# EAGLE design LOGO LED board (EAGLE 9.5.0)
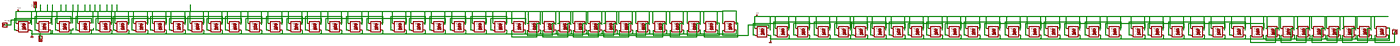
[diagram p0: schematic, sheet 1, overview]
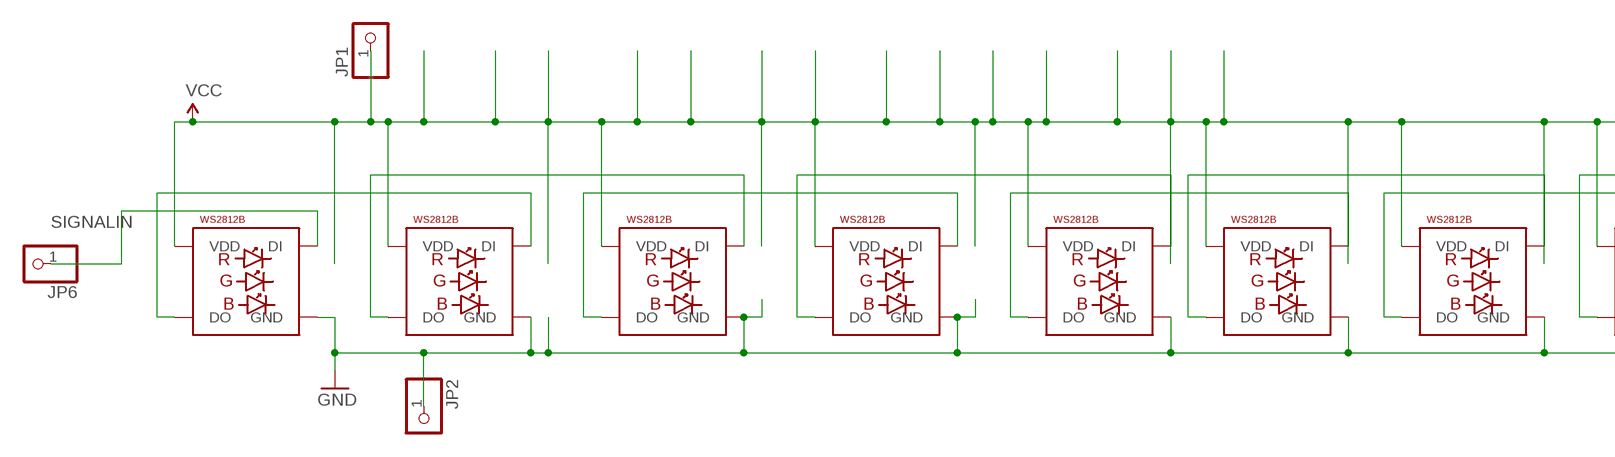
[diagram p1: schematic, sheet 1, part 1 of 8]
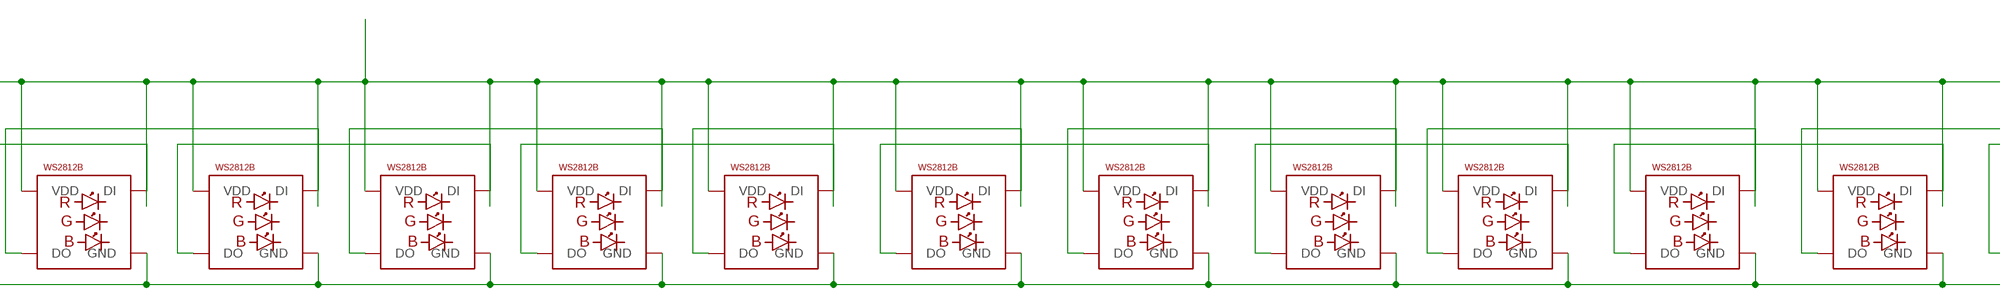
[diagram p2: schematic, sheet 1, part 2 of 8]
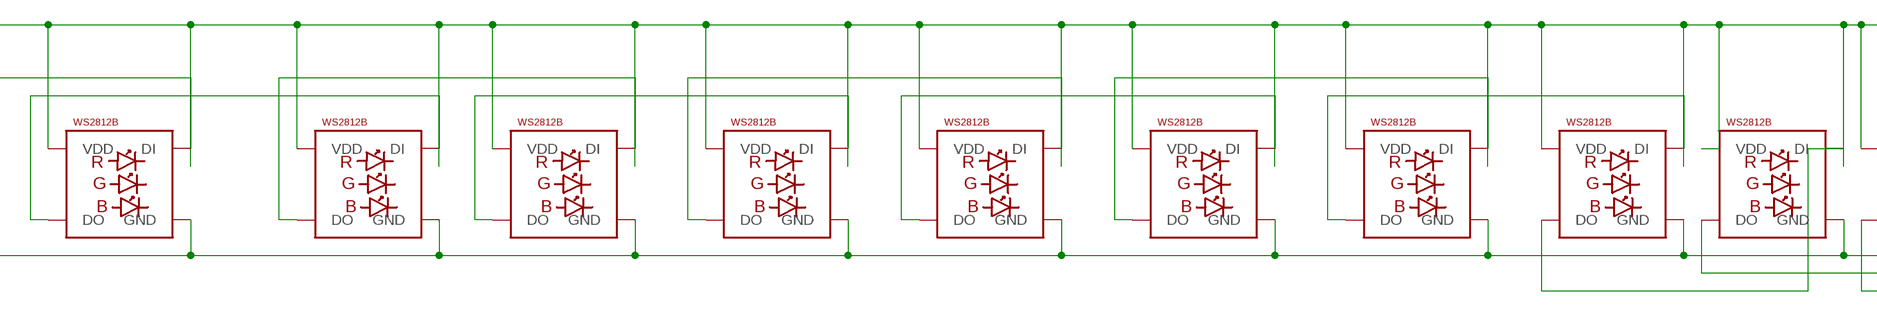
[diagram p3: schematic, sheet 1, part 3 of 8]
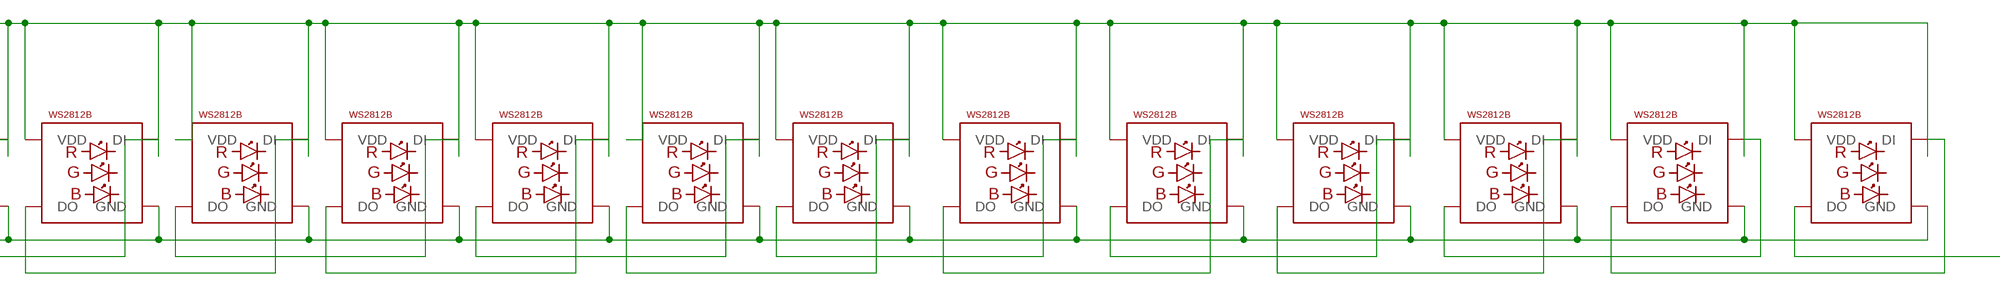
[diagram p4: schematic, sheet 1, part 4 of 8]
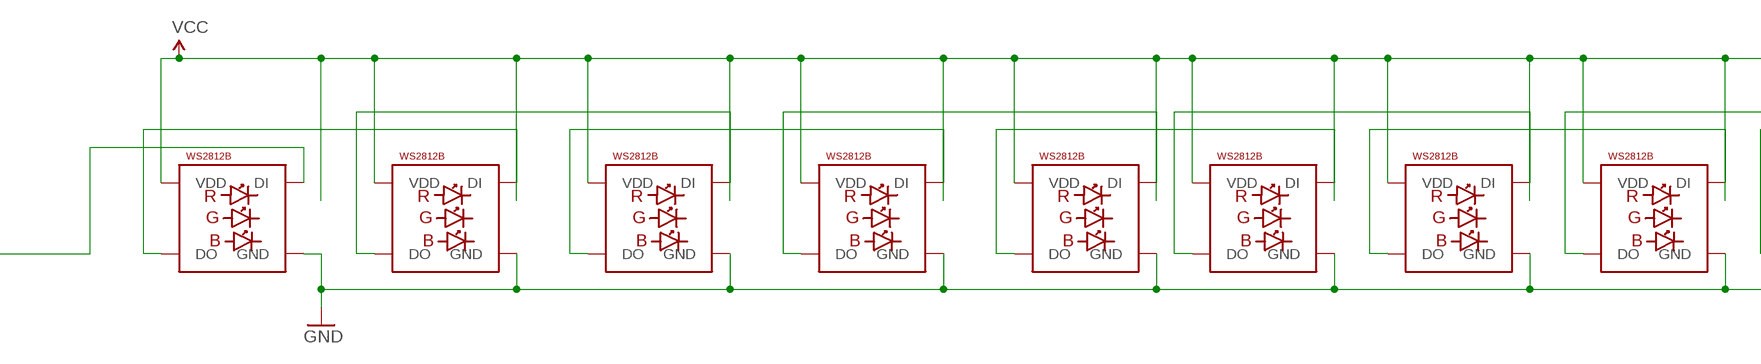
[diagram p5: schematic, sheet 1, part 5 of 8]
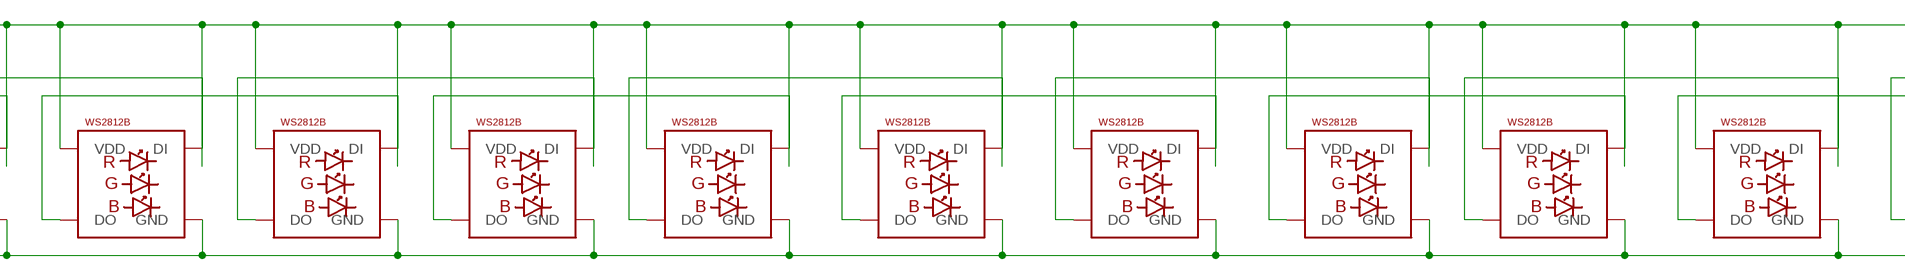
[diagram p6: schematic, sheet 1, part 6 of 8]
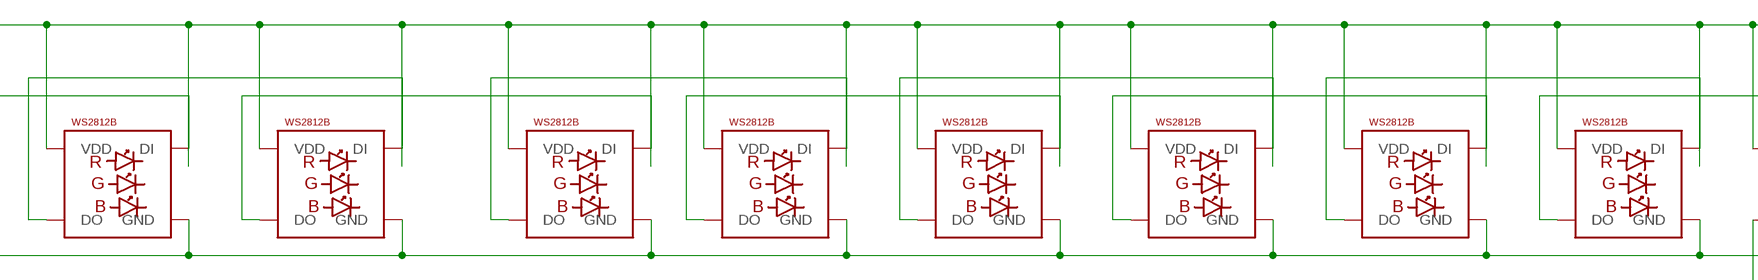
[diagram p7: schematic, sheet 1, part 7 of 8]
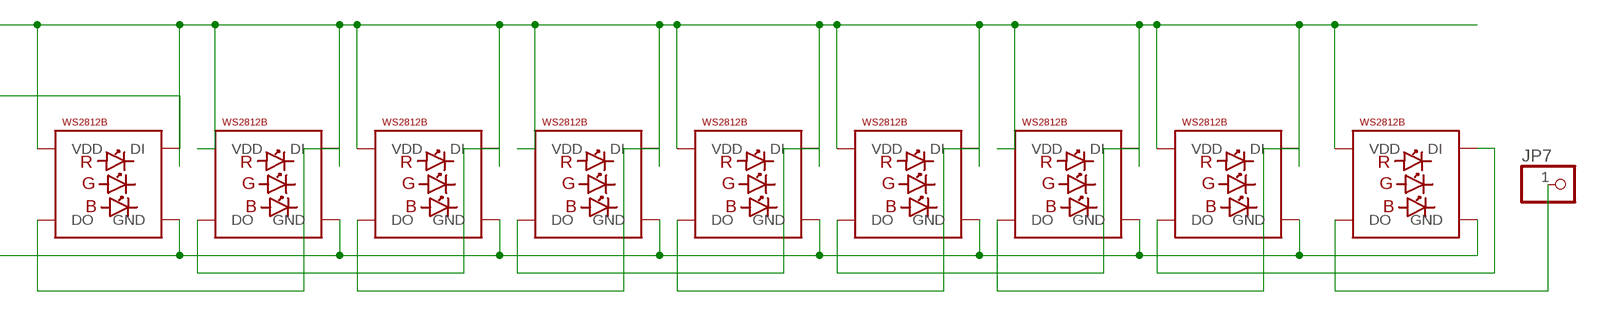
[diagram p8: schematic, sheet 1, part 8 of 8]

## Parts
JP1  PINHD-1X1  [1X01]
JP2  PINHD-1X1  [1X01]
JP6  PINHD-1X1  [1X01]
JP7  PINHD-1X1  [1X01]
LED1  WS2812B5050  [WS2812B]
LED2  WS2812B5050  [WS2812B]
LED3  WS2812B5050  [WS2812B]
LED4  WS2812B5050  [WS2812B]
LED5  WS2812B5050  [WS2812B]
LED6  WS2812B5050  [WS2812B]
LED7  WS2812B5050  [WS2812B]
LED8  WS2812B5050  [WS2812B]
LED9  WS2812B5050  [WS2812B]
LED10  WS2812B5050  [WS2812B]
LED11  WS2812B5050  [WS2812B]
LED12  WS2812B5050  [WS2812B]
LED13  WS2812B5050  [WS2812B]
LED14  WS2812B5050  [WS2812B]
LED15  WS2812B5050  [WS2812B]
LED16  WS2812B5050  [WS2812B]
LED17  WS2812B5050  [WS2812B]
LED18  WS2812B5050  [WS2812B]
LED19  WS2812B5050  [WS2812B]
LED20  WS2812B5050  [WS2812B]
LED21  WS2812B5050  [WS2812B]
LED22  WS2812B5050  [WS2812B]
LED23  WS2812B5050  [WS2812B]
LED24  WS2812B5050  [WS2812B]
LED25  WS2812B5050  [WS2812B]
LED26  WS2812B5050  [WS2812B]
LED27  WS2812B5050  [WS2812B]
LED28  WS2812B5050  [WS2812B]
LED29  WS2812B5050  [WS2812B]
LED30  WS2812B5050  [WS2812B]
LED31  WS2812B5050  [WS2812B]
LED32  WS2812B5050  [WS2812B]
LED33  WS2812B5050  [WS2812B]
LED34  WS2812B5050  [WS2812B]
LED35  WS2812B5050  [WS2812B]
LED36  WS2812B5050  [WS2812B]
LED37  WS2812B5050  [WS2812B]
LED38  WS2812B5050  [WS2812B]
LED39  WS2812B5050  [WS2812B]
LED40  WS2812B5050  [WS2812B]
LED41  WS2812B5050  [WS2812B]
LED42  WS2812B5050  [WS2812B]
LED43  WS2812B5050  [WS2812B]
LED44  WS2812B5050  [WS2812B]
LED45  WS2812B5050  [WS2812B]
LED46  WS2812B5050  [WS2812B]
LED47  WS2812B5050  [WS2812B]
LED48  WS2812B5050  [WS2812B]
LED49  WS2812B5050  [WS2812B]
LED50  WS2812B5050  [WS2812B]
LED51  WS2812B5050  [WS2812B]
LED52  WS2812B5050  [WS2812B]
LED53  WS2812B5050  [WS2812B]
LED54  WS2812B5050  [WS2812B]
LED55  WS2812B5050  [WS2812B]
LED56  WS2812B5050  [WS2812B]
LED57  WS2812B5050  [WS2812B]
LED58  WS2812B5050  [WS2812B]
LED59  WS2812B5050  [WS2812B]
LED60  WS2812B5050  [WS2812B]
LED61  WS2812B5050  [WS2812B]
LED62  WS2812B5050  [WS2812B]
LED63  WS2812B5050  [WS2812B]
LED64  WS2812B5050  [WS2812B]
LED65  WS2812B5050  [WS2812B]
LED66  WS2812B5050  [WS2812B]
LED67  WS2812B5050  [WS2812B]
LED68  WS2812B5050  [WS2812B]
LED69  WS2812B5050  [WS2812B]
LED70  WS2812B5050  [WS2812B]
LED71  WS2812B5050  [WS2812B]
LED72  WS2812B5050  [WS2812B]
LED73  WS2812B5050  [WS2812B]

## Nets
5V: JP1.1 LED1.1-VDD(VDD) LED2.1-VDD(VDD) LED3.1-VDD(VDD) LED4.1-VDD(VDD) LED5.1-VDD(VDD) LED6.1-VDD(VDD) LED7.1-VDD(VDD) LED8.1-VDD(VDD) LED9.1-VDD(VDD) LED10.1-VDD(VDD) LED11.1-VDD(VDD) LED12.1-VDD(VDD) LED13.1-VDD(VDD) LED14.1-VDD(VDD) LED15.1-VDD(VDD) LED16.1-VDD(VDD) LED17.1-VDD(VDD) LED18.1-VDD(VDD) LED19.1-VDD(VDD) LED20.1-VDD(VDD) LED21.1-VDD(VDD) LED22.1-VDD(VDD) LED23.1-VDD(VDD) LED24.1-VDD(VDD) LED25.1-VDD(VDD) LED26.1-VDD(VDD) LED27.1-VDD(VDD) LED28.1-VDD(VDD) LED29.1-VDD(VDD) LED30.1-VDD(VDD) LED31.1-VDD(VDD) LED32.1-VDD(VDD) LED33.1-VDD(VDD) LED34.1-VDD(VDD) LED35.1-VDD(VDD) LED36.1-VDD(VDD) LED37.1-VDD(VDD) LED38.1-VDD(VDD) LED39.1-VDD(VDD) LED40.1-VDD(VDD) LED41.1-VDD(VDD) LED42.1-VDD(VDD) LED43.1-VDD(VDD) LED44.1-VDD(VDD) LED45.1-VDD(VDD) LED46.1-VDD(VDD) LED47.1-VDD(VDD) LED48.1-VDD(VDD) LED49.1-VDD(VDD) LED50.1-VDD(VDD) LED51.1-VDD(VDD) LED52.1-VDD(VDD) LED53.1-VDD(VDD) LED54.1-VDD(VDD) LED55.1-VDD(VDD) LED56.1-VDD(VDD) LED57.1-VDD(VDD) LED58.1-VDD(VDD) LED59.1-VDD(VDD) LED60.1-VDD(VDD) LED61.1-VDD(VDD) LED62.1-VDD(VDD) LED63.1-VDD(VDD) LED64.1-VDD(VDD) LED65.1-VDD(VDD) LED66.1-VDD(VDD) LED67.1-VDD(VDD) LED68.1-VDD(VDD) LED69.1-VDD(VDD) LED70.1-VDD(VDD) LED71.1-VDD(VDD) LED72.1-VDD(VDD) LED73.1-VDD(VDD) ; supply symbol labelled VCC
GND: JP2.1 LED1.3-GND(GND) LED2.3-GND(GND) LED3.3-GND(GND) LED4.3-GND(GND) LED5.3-GND(GND) LED6.3-GND(GND) LED7.3-GND(GND) LED8.3-GND(GND) LED9.3-GND(GND) LED10.3-GND(GND) LED11.3-GND(GND) LED12.3-GND(GND) LED13.3-GND(GND) LED14.3-GND(GND) LED15.3-GND(GND) LED16.3-GND(GND) LED17.3-GND(GND) LED18.3-GND(GND) LED19.3-GND(GND) LED20.3-GND(GND) LED21.3-GND(GND) LED22.3-GND(GND) LED23.3-GND(GND) LED24.3-GND(GND) LED25.3-GND(GND) LED26.3-GND(GND) LED27.3-GND(GND) LED28.3-GND(GND) LED29.3-GND(GND) LED30.3-GND(GND) LED31.3-GND(GND) LED32.3-GND(GND) LED33.3-GND(GND) LED34.3-GND(GND) LED35.3-GND(GND) LED36.3-GND(GND) LED37.3-GND(GND) LED38.3-GND(GND) LED39.3-GND(GND) LED40.3-GND(GND) LED41.3-GND(GND) LED42.3-GND(GND) LED43.3-GND(GND) LED44.3-GND(GND) LED45.3-GND(GND) LED46.3-GND(GND) LED47.3-GND(GND) LED48.3-GND(GND) LED49.3-GND(GND) LED50.3-GND(GND) LED51.3-GND(GND) LED52.3-GND(GND) LED53.3-GND(GND) LED54.3-GND(GND) LED55.3-GND(GND) LED56.3-GND(GND) LED57.3-GND(GND) LED58.3-GND(GND) LED59.3-GND(GND) LED60.3-GND(GND) LED61.3-GND(GND) LED62.3-GND(GND) LED63.3-GND(GND) LED64.3-GND(GND) LED65.3-GND(GND) LED66.3-GND(GND) LED67.3-GND(GND) LED68.3-GND(GND) LED69.3-GND(GND) LED70.3-GND(GND) LED71.3-GND(GND) LED72.3-GND(GND) LED73.3-GND(GND)
N$1: LED5.2-DOUT(DO) LED6.4-DIN(DI)
N$2: LED1.2-DOUT(DO) LED2.4-DIN(DI)
N$3: LED2.2-DOUT(DO) LED3.4-DIN(DI)
N$4: LED3.2-DOUT(DO) LED4.4-DIN(DI)
N$5: LED4.2-DOUT(DO) LED5.4-DIN(DI)
N$6: LED6.2-DOUT(DO) LED7.4-DIN(DI)
N$7: LED7.2-DOUT(DO) LED8.4-DIN(DI)
N$8: LED8.2-DOUT(DO) LED9.4-DIN(DI)
N$9: LED9.2-DOUT(DO) LED10.4-DIN(DI)
N$10: LED10.2-DOUT(DO) LED11.4-DIN(DI)
N$11: LED11.2-DOUT(DO) LED12.4-DIN(DI)
N$12: LED12.2-DOUT(DO) LED13.4-DIN(DI)
N$13: LED13.2-DOUT(DO) LED14.4-DIN(DI)
N$14: LED14.2-DOUT(DO) LED15.4-DIN(DI)
N$15: LED15.2-DOUT(DO) LED16.4-DIN(DI)
N$16: LED16.2-DOUT(DO) LED17.4-DIN(DI)
N$17: LED17.2-DOUT(DO) LED18.4-DIN(DI)
N$18: LED18.2-DOUT(DO) LED19.4-DIN(DI)
N$19: LED19.2-DOUT(DO) LED20.4-DIN(DI)
N$20: LED20.2-DOUT(DO) LED21.4-DIN(DI)
N$21: LED21.2-DOUT(DO) LED22.4-DIN(DI)
N$22: LED22.2-DOUT(DO) LED23.4-DIN(DI)
N$23: LED23.2-DOUT(DO) LED24.4-DIN(DI)
N$24: LED24.2-DOUT(DO) LED25.4-DIN(DI)
N$25: LED25.2-DOUT(DO) LED26.4-DIN(DI)
N$26: LED26.2-DOUT(DO) LED27.4-DIN(DI)
N$27: LED27.2-DOUT(DO) LED28.4-DIN(DI)
N$28: LED28.2-DOUT(DO) LED29.4-DIN(DI)
N$29: LED29.2-DOUT(DO) LED30.4-DIN(DI)
N$30: LED30.2-DOUT(DO) LED31.4-DIN(DI)
N$31: LED31.2-DOUT(DO) LED32.4-DIN(DI)
N$32: LED32.2-DOUT(DO) LED33.4-DIN(DI)
N$33: LED33.2-DOUT(DO) LED34.4-DIN(DI)
N$34: LED34.2-DOUT(DO) LED35.4-DIN(DI)
N$35: LED35.2-DOUT(DO) LED36.4-DIN(DI)
N$36: LED36.2-DOUT(DO) LED37.4-DIN(DI)
N$37: LED37.2-DOUT(DO) LED38.4-DIN(DI)
N$38: LED38.2-DOUT(DO) LED39.4-DIN(DI)
N$39: LED40.2-DOUT(DO) LED41.4-DIN(DI)
N$40: LED42.2-DOUT(DO) LED43.4-DIN(DI)
N$41: LED43.2-DOUT(DO) LED44.4-DIN(DI)
N$42: LED44.2-DOUT(DO) LED45.4-DIN(DI)
N$43: LED45.2-DOUT(DO) LED46.4-DIN(DI)
N$44: LED46.2-DOUT(DO) LED47.4-DIN(DI)
N$45: LED47.2-DOUT(DO) LED48.4-DIN(DI)
N$46: LED48.2-DOUT(DO) LED49.4-DIN(DI)
N$47: LED49.2-DOUT(DO) LED50.4-DIN(DI)
N$48: LED50.2-DOUT(DO) LED51.4-DIN(DI)
N$49: LED51.2-DOUT(DO) LED52.4-DIN(DI)
N$50: LED52.2-DOUT(DO) LED53.4-DIN(DI)
N$51: LED53.2-DOUT(DO) LED54.4-DIN(DI)
N$52: LED54.2-DOUT(DO) LED55.4-DIN(DI)
N$53: LED55.2-DOUT(DO) LED56.4-DIN(DI)
N$54: LED56.2-DOUT(DO) LED57.4-DIN(DI)
N$55: LED57.2-DOUT(DO) LED58.4-DIN(DI)
N$56: LED58.2-DOUT(DO) LED59.4-DIN(DI)
N$57: LED59.2-DOUT(DO) LED60.4-DIN(DI)
N$58: LED60.2-DOUT(DO) LED61.4-DIN(DI)
N$59: LED61.2-DOUT(DO) LED62.4-DIN(DI)
N$60: LED62.2-DOUT(DO) LED63.4-DIN(DI)
N$61: LED63.2-DOUT(DO) LED64.4-DIN(DI)
N$62: LED64.2-DOUT(DO) LED65.4-DIN(DI)
N$63: LED41.2-DOUT(DO) LED42.4-DIN(DI)
N$64: LED65.2-DOUT(DO) LED66.4-DIN(DI)
N$65: LED66.2-DOUT(DO) LED67.4-DIN(DI)
N$66: LED67.2-DOUT(DO) LED68.4-DIN(DI)
N$67: LED68.2-DOUT(DO) LED69.4-DIN(DI)
N$68: LED69.2-DOUT(DO) LED70.4-DIN(DI)
N$69: LED70.2-DOUT(DO) LED71.4-DIN(DI)
N$70: LED71.2-DOUT(DO) LED72.4-DIN(DI)
N$71: LED72.2-DOUT(DO) LED73.4-DIN(DI)
N$77: LED39.2-DOUT(DO) LED40.4-DIN(DI)
N$80: JP7.1 LED73.2-DOUT(DO)
SIGNALIN: JP6.1 LED1.4-DIN(DI)

## Library data of the parts
JP1 JP2 JP6 JP7 = adafruit:PINHD-1X1: Pin header 1x1 for 0.1" spacing With round pins
LED1-LED73 = freetronics-jon:WS2812B

## Board
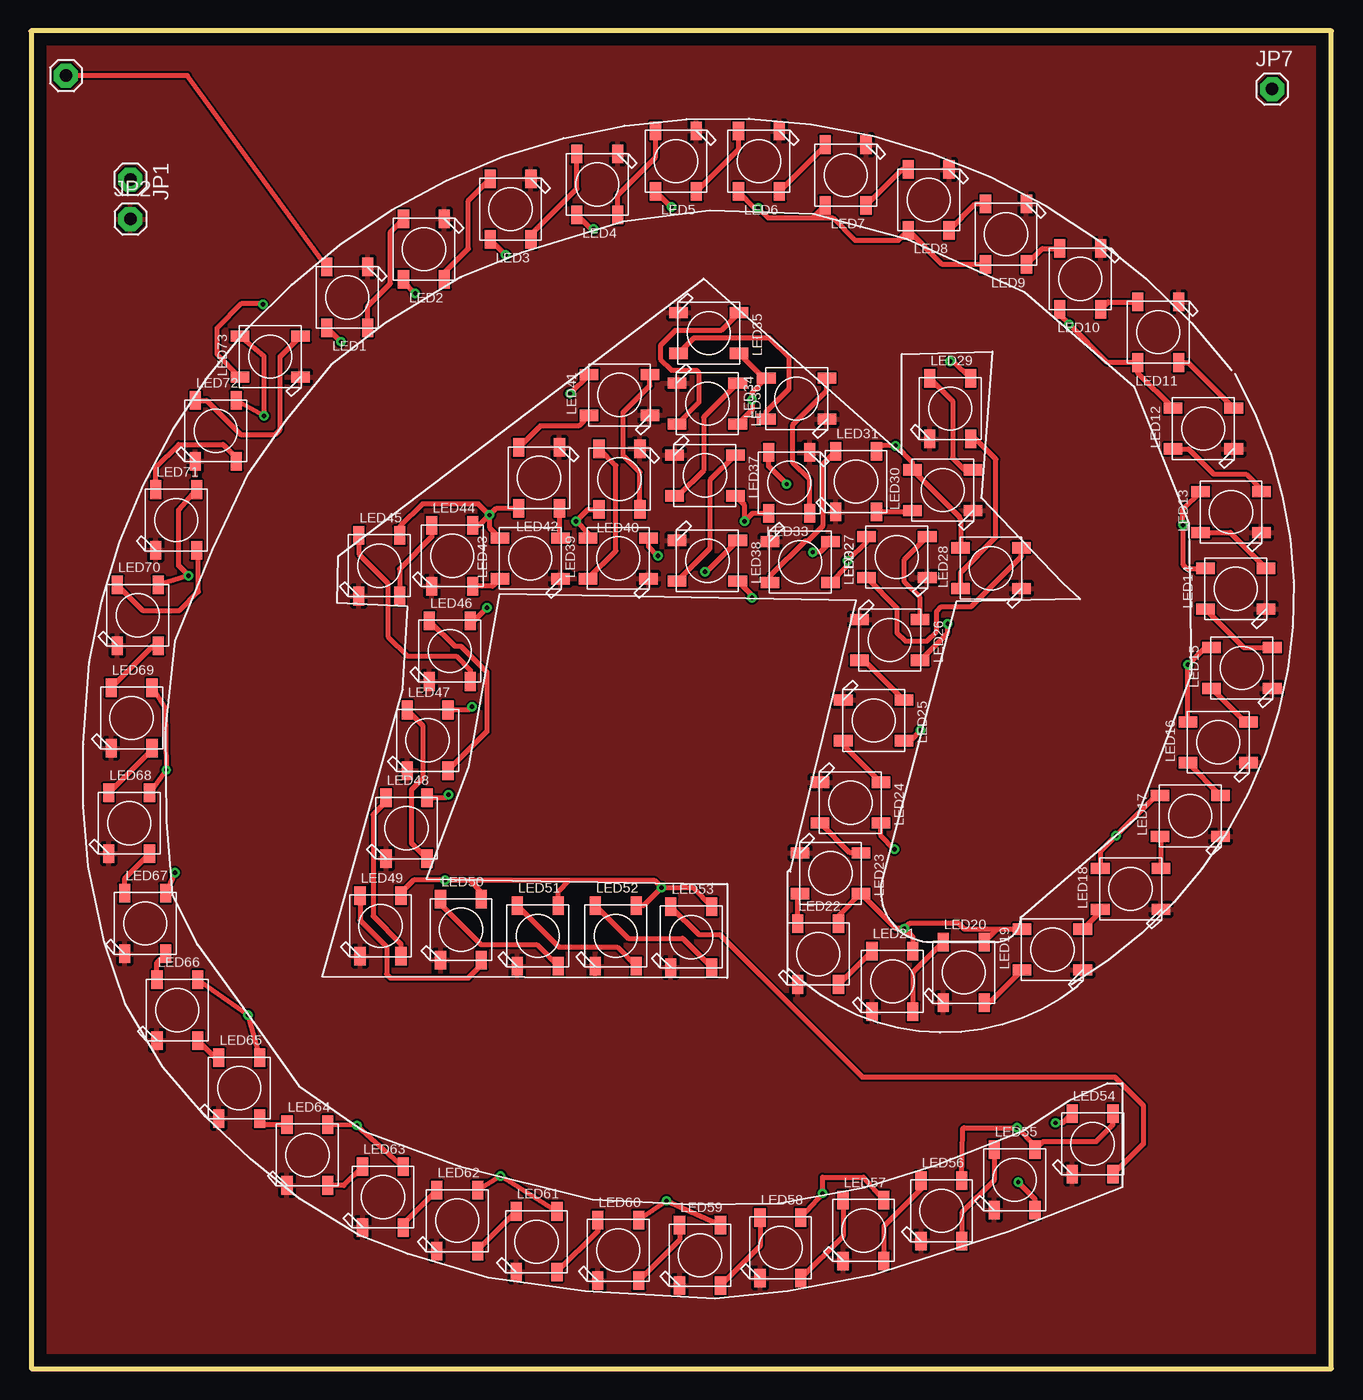
[diagram p9: board, top side]
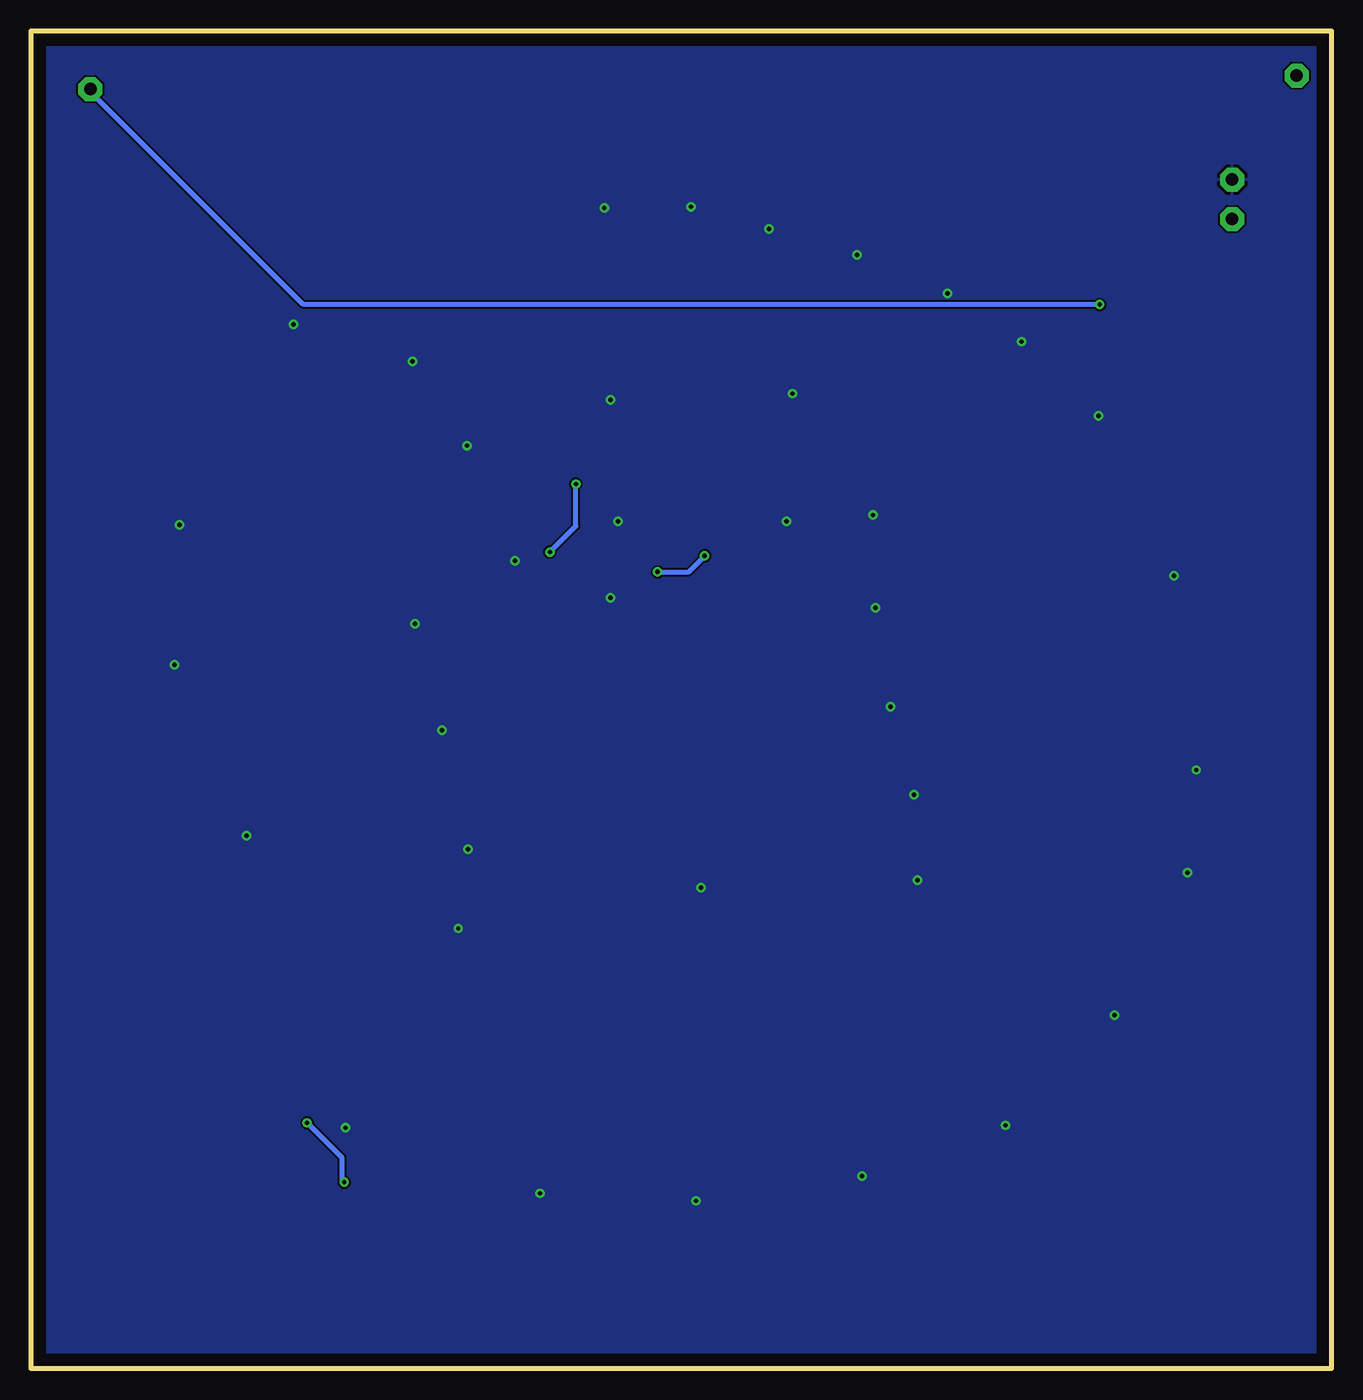
[diagram p10: board, bottom side, seen from below]

Size 105.03 x 108.05 mm. Coordinates in mm from the lower left corner, seen from the top.
Outline: 0.03,108.05 105.03,108.05 105.03,0.05
Outline: 0.03,108.03 0.03,0 105.01,0 105.01,108.05 0.03,108.05 0.03,108.03
Outline: 0.03,108.03 0,108.03 0,108.05
Copper layers (1*16): Top 0.035mm / dielectric 1.5mm / Bottom 0.035mm
Design rules "default": minimum track width 6mil, minimum drill 0.35mm, track to track 6mil, track to pad 6mil, pad to pad 6mil, via to via 6mil, smd to smd 6mil, copper to edge 40mil, drill to drill 6mil, minimum pad ring 10mil, minimum via ring 8mil, stop-mask expansion 4mil, vias tented up to drill 0mil, thermal gap 10mil

### Footprints (pad centres in the part's own frame; a part is rotated, then mirrored left to right if it is on the bottom)
1X01 = drill 1.016 pad 1.93 octagon: 1 0,0
WS2812B = smd 1.5 x 0.9: 1-VDD 2.45,-1.65; 2-DOUT 2.45,1.65; 3-GND -2.45,1.65; 4-DIN -2.45,-1.65

### Placement (x,y rotation side)
JP1  8.03,96.05 270 top
JP2  8.03,92.85 0 top
JP6  2.83,104.45 0 top
JP7  100.23,103.35 0 top
LED1  25.54,86.53 270 top
LED2  31.74,90.42 270 top
LED3  38.73,93.65 270 top
LED4  45.73,95.65 270 top
LED5  52.09,97.53 270 top
LED6  58.79,97.52 270 top
LED7  65.79,96.41 270 top
LED8  72.49,94.4 270 top
LED9  78.74,91.63 270 top
LED10  84.74,88.02 270 top
LED11  91.04,83.71 270 top
LED12  94.68,75.94 180 top
LED13  96.91,69.19 180 top
LED14  97.3,62.99 180 top
LED15  97.79,56.59 180 top
LED16  95.88,50.59 180 top
LED17  93.61,44.64 180 top
LED18  88.8,38.74 180 top
LED19  82.49,33.84 180 top
LED20  75.32,32 90 top
LED21  69.57,31.27 90 top
LED22  63.57,33.48 90 top
LED23  64.57,40.01 0 top
LED24  66.18,45.71 0 top
LED25  68.05,52.36 0 top
LED26  69.36,58.86 0 top
LED27  69.93,65.55 180 top
LED28  77.53,64.65 180 top
LED29  74.23,77.55 90 top
LED30  73.63,70.95 180 top
LED31  66.63,71.65 90 top
LED32  62.13,65.15 0 top
LED33  61.23,71.55 270 top
LED34  61.83,78.35 180 top
LED35  54.73,83.65 0 top
LED36  54.63,77.95 0 top
LED37  54.43,72.15 0 top
LED38  54.63,65.25 0 top
LED39  47.43,65.45 180 top
LED40  47.53,71.85 270 top
LED41  47.53,78.65 180 top
LED42  41.03,71.95 270 top
LED43  40.33,65.45 180 top
LED44  34.03,65.65 90 top
LED45  28.13,64.85 90 top
LED46  33.83,57.95 90 top
LED47  32.03,50.75 90 top
LED48  30.33,43.65 90 top
LED49  28.23,35.75 90 top
LED50  34.73,35.45 90 top
LED51  40.93,34.95 90 top
LED52  47.23,34.95 90 top
LED53  53.33,34.85 90 top
LED54  85.73,18.15 90 top
LED55  79.43,15.25 90 top
LED56  73.53,12.75 90 top
LED57  67.23,11.15 90 top
LED58  60.53,9.75 90 top
LED59  54.03,9.15 90 top
LED60  47.43,9.55 90 top
LED61  40.83,10.25 90 top
LED62  34.43,11.95 90 top
LED63  28.43,13.85 90 top
LED64  22.33,17.25 90 top
LED65  16.83,22.65 90 top
LED66  11.83,28.95 90 top
LED67  9.23,35.95 90 top
LED68  7.93,44.05 90 top
LED69  8.13,52.55 90 top
LED70  8.63,60.85 90 top
LED71  11.73,68.55 90 top
LED72  14.93,75.75 90 top
LED73  19.33,81.75 180 top

### Tracks (layer width: path | path; a pad name or v marks a point on that pad's centre or on a via)
5V  (via drill 0.35)
  Top 0.406: v25.03,82.95 LED1.1-VDD | LED72.1-VDD v18.83,76.95 18.83,81.75 LED73.1-VDD | LED71.1-VDD 11.93,69.35 11.93,64.85 v12.73,64.05 LED70.1-VDD | LED69.1-VDD 10.83,53.35 v10.93,48.35 LED68.1-VDD | v11.63,40.05 LED67.1-VDD | LED66.1-VDD v17.53,28.55 LED65.1-VDD | LED64.1-VDD v26.33,19.65 LED63.1-VDD | LED62.1-VDD v37.93,15.55 LED61.1-VDD | LED60.1-VDD v51.33,13.55 LED59.1-VDD | LED58.1-VDD v63.93,14.15 63.93,15.45 67.23,15.45 LED57.1-VDD | LED56.1-VDD 75.23,19.35 75.33,19.45 v79.63,19.45 81.08,18 LED55.1-VDD 81.73,18.35 86.03,18.35 87.38,19.7 LED54.1-VDD | v50.93,38.85 53.43,38.85 LED53.1-VDD | v50.93,38.85 49.48,37.4 LED52.1-VDD | 35.43,39.45 v33.43,39.45 30.93,39.45 29.88,38.4 LED49.1-VDD | 35.43,39.45 43.53,39.45 | 43.53,39.45 50.33,39.45 v50.93,38.85 | LED51.1-VDD 42.58,38.5 43.53,39.45 | LED50.1-VDD 36.38,38.5 35.43,39.45 | v33.73,46.35 33.48,46.1 LED48.1-VDD | v35.63,53.45 35.38,53.2 LED47.1-VDD | v36.83,61.45 35.78,60.4 LED46.1-VDD | v37.03,68.95 36.18,68.1 LED44.1-VDD | v37.03,68.95 37.03,67.95 LED43.1-VDD | v37.03,68.95 37.58,69.5 LED42.1-VDD | v37.03,68.95 36.13,69.85 31.63,69.85 29.78,68 LED45.1-VDD | LED40.1-VDD 44.98,69.4 v44.03,68.45 44.98,67.5 LED39.1-VDD | LED33.1-VDD 58.28,69.1 v57.63,68.45 57.63,69.75 LED37.1-VDD | LED36.1-VDD 58.23,77.45 v58.23,78.25 58.23,78.85 LED34.1-VDD 59.18,80 LED35.1-VDD | v43.53,78.75 LED41.1-VDD | LED31.1-VDD 68.73,74.55 v69.83,74.55 71.18,73.2 LED30.1-VDD 74.97,68.81 74.97,68.7 75.08,68.6 LED28.1-VDD | LED27.1-VDD 67.48,66.8 v65.93,65.25 65.93,64.85 LED32.1-VDD | LED26.1-VDD 74.03,59.43 v74.03,60.15 | v71.83,51.55 70.99,50.71 LED25.1-VDD
  Top 0.406: v69.73,41.95 68.63,43.05 LED24.1-VDD | v70.53,35.55 71.22,34.86 LED21.1-VDD | v70.53,35.55 69.83,35.55 LED23.1-VDD 65.22,36.56 LED22.1-VDD | LED19.1-VDD 78.01,35.49 | 78.01,35.49 LED20.1-VDD | 78.01,35.49 75.39,35.49 74.93,35.95 70.93,35.95 v70.53,35.55 | LED18.1-VDD 86.35,41.77 v87.63,43.05 90.87,46.29 LED17.1-VDD | LED16.1-VDD v93.43,56.85 94.82,58.24 LED15.1-VDD | LED14.1-VDD 93.34,64.64 93.03,64.95 v93.03,68.15 93.03,69.41 LED13.1-VDD | LED12.1-VDD 89.39,80.43 LED11.1-VDD 86.92,81.26 v83.83,84.35 83.09,85.09 LED10.1-VDD | LED9.1-VDD 73.61,89.18 LED8.1-VDD 70.04,91.15 66.53,91.15 64.73,92.95 63.13,92.95 | LED6.1-VDD 58.46,93.75 v58.73,93.75 59.53,92.95 63.13,92.95 | 63.13,92.95 LED7.1-VDD | v51.73,93.85 51.67,93.85 LED5.1-VDD | v45.43,92.05 45.23,92.05 LED4.1-VDD | v38.33,89.95 LED3.1-VDD | v31.03,86.85 30.09,87.79 LED2.1-VDD | v74.23,81.35 74.53,81.35 LED29.1-VDD | LED38.1-VDD 58.23,62.45 v58.23,62.25
  pour Bottom: 0.43,107.75 0.63,-0.15 105.03,0.05 105.03,108.35 0.23,108.15
GND
  pour Top: 0.13,107.95 0.13,-0.05 105.03,-0.05 105.03,108.05 0.23,108.05
N$1
  Top 0.406: LED5.2-DOUT 57.14,98.48 LED6.4-DIN
N$2
  Top 0.406: LED1.2-DOUT 27.19,85.81 29.03,87.65 29.03,91.81 LED2.4-DIN
N$3
  Top 0.406: LED2.2-DOUT 33.39,88.51 35.33,90.45 35.33,94.35 LED3.4-DIN
N$4
  Top 0.406: LED3.2-DOUT 40.38,91.6 44.08,95.3 LED4.4-DIN
N$5
  Top 0.406: LED4.2-DOUT 47.38,94.8 50.44,97.86 LED5.4-DIN
N$6
  Top 0.406: LED6.2-DOUT 64.14,98.77 LED7.4-DIN
N$7
  Top 0.406: LED7.2-DOUT 70.33,96.85 LED8.4-DIN
N$8
  Top 0.406: LED8.2-DOUT 76.27,94.08 LED9.4-DIN
N$9
  Top 0.406: LED9.2-DOUT 81.68,90.47 LED10.4-DIN
N$10
  Top 0.406: LED10.2-DOUT 86.98,86.16 LED11.4-DIN
N$11
  Top 0.406: LED11.2-DOUT 93.46,81.26 LED12.4-DIN
N$12
  Top 0.406: LED12.2-DOUT 93.49,74.29 95.53,72.25 98.13,72.25 99.36,71.02 LED13.4-DIN
N$13
  Top 0.406: LED13.2-DOUT 96.85,67.54 LED14.4-DIN
N$14
  Top 0.406: LED14.2-DOUT 97.95,58.24 LED15.4-DIN
N$15
  Top 0.406: LED15.2-DOUT 98.04,52.24 LED16.4-DIN
N$16
  Top 0.406: LED16.2-DOUT 96.06,46.31 LED17.4-DIN
N$17
  Top 0.406: LED17.2-DOUT 91.25,42.9 LED18.4-DIN
N$18
  Top 0.406: LED18.2-DOUT 86.35,36.9 LED19.4-DIN
N$19
  Top 0.406: LED19.2-DOUT 77.4,29.55 LED20.4-DIN
N$20
  Top 0.406: LED20.2-DOUT 71.22,32 LED21.4-DIN
N$21
  Top 0.406: LED21.2-DOUT LED22.4-DIN
N$22
  Top 0.406: LED22.2-DOUT 61.92,38.16 LED23.4-DIN
N$23
  Top 0.406: LED23.2-DOUT 66.13,41.66 LED24.4-DIN
N$24
  Top 0.406: LED24.2-DOUT 65.6,50.39 LED25.4-DIN
N$25
  Top 0.406: LED25.2-DOUT 67.3,57.21 LED26.4-DIN
N$26
  Top 0.406: LED26.2-DOUT 71.81,62.27 70.53,63.55 70.53,65.35 LED27.4-DIN
N$27
  Top 0.406: LED27.2-DOUT 69.93,61.45 69.93,59.45 70.63,58.75 72.33,58.75 73.13,59.55 73.13,61.15 73.53,61.55 75.93,61.55 79.98,65.6 LED28.4-DIN
N$28
  Top 0.406: LED28.2-DOUT 75.08,64.3 77.93,67.15 77.93,73.45 76.28,75.1 LED29.4-DIN
N$29
  Top 0.406: LED29.2-DOUT 74.43,78.15 74.43,73.55 75.38,72.6 LED30.4-DIN
N$30
  Top 0.406: LED30.2-DOUT 71.08,69.2 LED31.4-DIN
N$31
  Top 0.406: LED31.2-DOUT 63.93,73.05 63.93,68.05 62.73,66.85 62.53,66.85 59.68,64 LED32.4-DIN
N$32  (via drill 0.35)
  Top 0.406: LED32.2-DOUT 63.73,65.95 v63.13,65.95 | v61.03,71.45 59.58,72.9 LED33.4-DIN
  Bottom 0.406: v63.13,65.95 61.03,68.05 v61.03,71.45
N$33
  Top 0.406: LED33.2-DOUT 62.88,71.8 61.53,73.15 61.53,76.25 64.28,79 LED34.4-DIN
N$34
  Top 0.406: LED34.2-DOUT 59.38,77.3 61.23,79.15 61.23,81.65 59.63,83.25 53.53,83.25 LED35.4-DIN
N$35
  Top 0.406: LED35.2-DOUT 55.73,83.85 52.03,83.85 50.83,82.65 50.83,81.55 51.73,80.65 53.73,80.65 53.93,80.45 53.93,78.05 LED36.4-DIN
N$36
  Top 0.406: LED36.2-DOUT 54.33,76.85 54.33,72.55 52.28,70.5 LED37.4-DIN
N$37
  Top 0.406: LED37.2-DOUT 54.83,71.75 54.83,66.25 LED38.4-DIN
N$38  (via drill 0.35)
  Top 0.406: LED38.2-DOUT 54.53,64.35 v54.43,64.35 | v50.63,65.65 49.88,66.4 LED39.4-DIN
  Bottom 0.406: v54.43,64.35 51.93,64.35 v50.63,65.65
N$39
  Top 0.406: LED40.2-DOUT 49.18,72.4 47.83,73.75 47.83,77.25 49.98,79.4 LED41.4-DIN
N$40
  Top 0.406: LED42.2-DOUT 42.68,67.2 LED43.4-DIN
N$41
  Top 0.406: LED43.2-DOUT 37.28,63.2 LED44.4-DIN
N$42
  Top 0.406: LED44.2-DOUT 32.38,67.2 29.78,64.6 LED45.4-DIN
N$43
  Top 0.406: LED45.2-DOUT 26.48,65.8 28.83,63.45 28.83,59.15 30.43,57.55 34.33,57.55 35.48,56.4 LED46.4-DIN
N$44
  Top 0.406: LED46.2-DOUT 34.23,58.35 34.73,58.35 36.83,56.25 36.83,51.45 LED47.4-DIN
N$45
  Top 0.406: LED47.2-DOUT 31.63,51.95 31.63,47.65 30.73,46.75 30.73,42.45 LED48.4-DIN
N$46
  Top 0.406: LED48.2-DOUT 28.68,45.8 27.63,44.75 27.63,36.55 29.88,34.3 LED49.4-DIN
N$47
  Top 0.406: LED49.2-DOUT 26.58,36.2 28.73,34.05 28.73,31.85 29.03,31.55 35.33,31.55 36.38,32.6 LED50.4-DIN
N$48
  Top 0.406: LED50.2-DOUT 33.08,37.5 36.33,34.25 40.83,34.25 LED51.4-DIN
N$49
  Top 0.406: LED51.2-DOUT 42.63,34.05 47.33,34.05 LED52.4-DIN
N$50
  Top 0.406: LED52.2-DOUT 48.23,34.75 52.63,34.75 LED53.4-DIN
N$51
  Top 0.406: LED53.2-DOUT 53.93,35.05 55.63,35.05 67.13,23.55 87.53,23.55 89.83,21.25 89.83,18.15 LED54.4-DIN
N$52  (via drill 0.35)
  Top 0.406: LED54.2-DOUT 83.33,19.85 v82.73,19.85 | v79.73,15.05 81.08,13.7 LED55.4-DIN
  Bottom 0.406: v82.73,19.85 79.93,17.05 79.93,15.05 v79.73,15.05
N$53
  Top 0.406: LED55.2-DOUT 77.78,15.2 75.18,12.6 LED56.4-DIN
N$54
  Top 0.406: LED56.2-DOUT 71.88,14.5 68.88,11.5 LED57.4-DIN
N$55
  Top 0.406: LED57.2-DOUT 65.58,10.7 LED58.4-DIN
N$56
  Top 0.406: LED58.2-DOUT 58.88,9.9 LED59.4-DIN
N$57
  Top 0.406: LED59.2-DOUT 52.38,10.4 LED60.4-DIN
N$58
  Top 0.406: LED60.2-DOUT 45.78,11.1 LED61.4-DIN
N$59
  Top 0.406: LED61.2-DOUT 36.08,9.6 LED62.4-DIN
N$60
  Top 0.406: LED62.2-DOUT 30.08,11.7 LED63.4-DIN
N$61
  Top 0.406: LED63.2-DOUT 25.28,14.8 LED64.4-DIN
N$62
  Top 0.406: LED64.2-DOUT 18.98,19.7 LED65.4-DIN
N$63
  Top 0.406: LED41.2-DOUT 44.23,76.15 41.13,76.15 LED42.4-DIN
N$64
  Top 0.406: LED65.2-DOUT 14.88,25.1 LED66.4-DIN
N$65
  Top 0.406: LED66.2-DOUT 10.18,32.8 LED67.4-DIN
N$66
  Top 0.406: LED67.2-DOUT 7.58,39.6 LED68.4-DIN
N$67
  Top 0.406: LED68.2-DOUT 9.78,50 LED69.4-DIN
N$68
  Top 0.406: LED69.2-DOUT 9.88,58.4 LED70.4-DIN
N$69
  Top 0.406: LED70.2-DOUT 9.03,61.25 12.03,61.25 13.53,62.75 13.53,65.95 LED71.4-DIN
N$70
  Top 0.406: LED71.2-DOUT 10.08,72.8 11.93,74.65 15.53,74.65 16.58,73.6 LED72.4-DIN
N$71
  Top 0.406: LED72.2-DOUT 14.18,78.2 16.93,75.45 19.73,75.45 20.13,75.85 20.13,81.75 LED73.4-DIN
N$77
  Top 0.406: LED39.2-DOUT 47.23,66.05 47.23,72.95 LED40.4-DIN
N$80  (via drill 0.35)
  Top 0.406: LED73.2-DOUT 15.03,81.95 15.03,84.05 17.03,86.05 18.73,86.05 v18.73,85.95
  Bottom 0.406: v18.73,85.95 83.03,85.95 100.23,103.15 JP7.1
SIGNALIN
  Top 0.406: LED1.4-DIN 12.63,104.45 JP6.1